# Altium schematic sheet Schema_Soldeerbout4.SchDoc
size A4; SheetNumber: 5; SheetTotal: 6
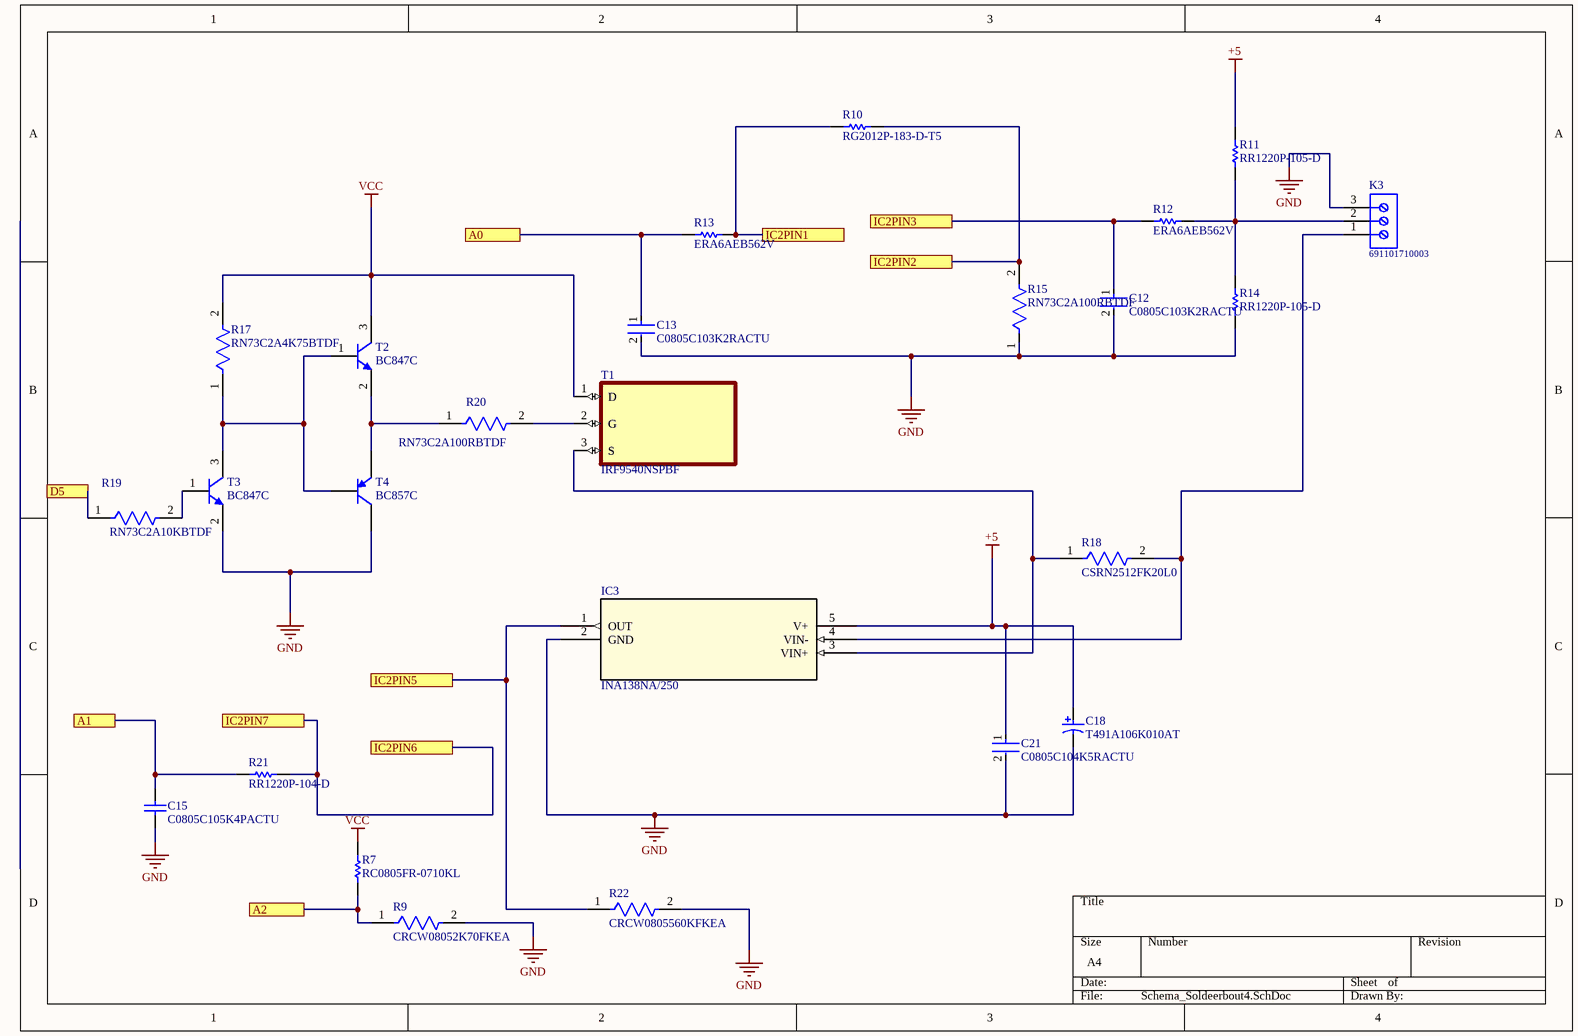
[diagram p0: Schema_Soldeerbout4.SchDoc]

## Parts
C12  C0805C103K2RACTU  [FP-C0805C-DN-MFG]
C13  C0805C103K2RACTU  [FP-C0805C-DN-MFG]
C15  C0805C105K4PACTU  [CAPC2013X145X50LL20T25]
C18  T491A106K010AT  [KEMT-A-3216-18-2_M]
C21  C0805C104K5RACTU  [FP-C0805C-DN-MFG]
IC3  INA138NA/250  [DBV5]
K3  691101710003  [691101710003]
R7  RC0805FR-0710KL  [RESC2013X60X35NL10T20]
R9  CRCW08052K70FKEA  [FP-CRCW0805-e3-IPC_C]
R10  RG2012P-183-D-T5  [RESC2013X50X40LL20T20]
R11  RR1220P-105-D  [RESC2013X50X40ML20T20]
R12  ERA6AEB562V  [RESC2013X60X40ML20T25]
R13  ERA6AEB562V  [RESC2013X60X40ML20T25]
R14  RR1220P-105-D  [RESC2013X50X40ML20T20]
R15  RN73C2A100RBTDF  [FP-RN732A-MFG]
R17  RN73C2A4K75BTDF  [FP-RN732A-MFG]
R18  CSRN2512FK20L0  [FP-CSRN2512-IPC_C]
R19  RN73C2A10KBTDF  [FP-RN732A-MFG]
R20  RN73C2A100RBTDF  [FP-RN732A-MFG]
R21  RR1220P-104-D  [RESC2013X50X40LL20T20]
R22  CRCW0805560KFKEA  [FP-CRCW0805-e3-IPC_A]
T1  IRF9540NSPBF  [DPAK508P1524X483-3N]
T2  BC847C  [INF-SOT23_L]
T3  BC847C  [INF-SOT23_L]
T4  BC857C  [INF-SOT23_N]

## Ports
A0, A1, A2, D5, IC2PIN1, IC2PIN2, IC2PIN3, IC2PIN5, IC2PIN6, IC2PIN7

## Nets
+5: C18.1 C21.1 IC3.5(V+) R11.2
GND: C12.2 C13.2 C15.1 C18.2 C21.2 IC3.2(GND) K3.3 R9.2 R14.1 R15.1 R22.2 T3.2(E) T4.3(C)
VCC: R7.2 R17.2 T1.1(D) T2.3(C)
A0: C13.1 R13.1 ; port A0
A1: C15.2 R21.1 ; port A1
A2: R7.1 R9.1 ; port A2
D5: R19.1 ; port D5
IC2PIN1: R10.1 R13.2 ; port IC2PIN1
IC2PIN2: R10.2 R15.2 ; port IC2PIN2
IC2PIN3: C12.1 R12.1 ; port IC2PIN3
IC2PIN5: IC3.1(OUT) R22.1 ; port IC2PIN5
IC2PIN6: R21.2 ; port IC2PIN6, port IC2PIN7
NetIC3_3: IC3.3(VIN+) R18.1 T1.3(S)
NetIC3_4: IC3.4(VIN-) K3.1 R18.2
NetK3_2: K3.2 R11.1 R12.2 R14.2
NetR17_1: R17.1 T2.1(B) T3.3(C) T4.1(B)
NetR19_2: R19.2 T3.1(B)
NetR20_1: R20.1 T2.2(E) T4.2(E)
NetR20_2: R20.2 T1.2(G)

## Library data of the parts
C12 C13 = CMP-2007-00259-2: CAP CER 10000PF 200V X7R 0805; Manufacturer: KEMET; Material: Ceramic; Temperature Coefficient: 30ppm/°C; Capacitance: 10,000 pF; Tolerance: 0.1; Value: 10,000 pF; Device Class L2: Capacitors; Voltage Rating: 200 V; Temperature Range High: +125°C; ComponentLink2Description: Datasheet; Height: 0.88mm; Octopart: https://octopart.com/c0805c103k2ractu-kemet-9138347; ComponentLink2URL: https://content.kemet.com/datasheets/KEM_C1003_C0G_SMD.pdf; Category: Cap; Temperature: -55°C to +125°C; Temperature Range Low: -55°C; Digikey Description: CAP CER 10000PF 200V X7R 0805; Manufacturer Part Number: C0805C103K2RACTU; Temperature Characteristic: X7R; Automotive: No; Device Class L3: Ceramic Capacitors; Mouser Description: KEMET - C0805C103K2RACTU - CAP, MLCC, X7R, 10NF, 200V, 0805; RoHS: TRUE; Device Class L1: Passive Components; Lead Free: Yes; Package: C0805C-DN; Ipc Land Pattern Name: CAPC200125X78
C15 = CMP-1036-04746-2: Manufacturer: Kemet; Part Number: C0805C105K4PACTU
C18 = CMP-2000-05172-1: Capacitor, Tantalum, 10 uF, +/- 10%, 10 V, -55 to 125 degC, 2-Pin SMD (1206), RoHS, Tape and Reel; Manufacturer Size Code: A; Manufacturer: Kemet; Type: Molded; Online Catalog: T491Series; Other Names: 399-3684-2; Voltage - Rated: 10V; Lifetime @ Temp.: 2000Hrs@85degC; Product Training Modules: CapacitorBasics-TypicalUsesforCapacitorsDeratingGuidelinesforSurfaceMountTantalumCapacitors; ESR (Equivalent Series Resistance): 3.8Ohm; Capacitance: 10µF; Catalog Drawings: T49x,T5xxSeries_A-side1T49x,T5xxSeries_A,B-side2T49x,T5xxSeries_A,SBottom; Family: TantalumCapacitors; Manufacturer URL: http://www.kemet.com/; Datasheet URL: http://www.farnell.com/datasheets/1824869.pdf; Package Reference: 1206; Packaging: Tape&Reel(TR); Series: T491; Operating Temperature: -55degC~125degC; Mounting Type: SurfaceMount; Height - Seated (Max): 0.071"(1.80mm); Package / Case: 1206(3216Metric); Package Description: 2-Pin Surface Mount Device, Body 3.2 x 1.6 mm; Features: GeneralPurpose; Tolerance: ±10%; Lead Spacing: -; Size / Dimension: 0.126"Lx0.063"W(3.20mmx1.60mm); Standard Package: 2,000; Datasheet Version: Apr-14; Category: Capacitors
C21 = CMP-2007-00279-2: CAP CER 0.1UF 50V X7R 0805; Manufacturer: KEMET; Value: 0.10 μF; Tolerance: 0.1; Temperature Coefficient: 30ppm/°C; Material: Ceramic; Manufacturer Part Number: C0805C104K5RACTU; Device Class L2: Capacitors; Temperature Range Low: -55°C; Voltage Rating: 50 V; Digikey Description: CAP CER 0.1UF 50V X7R 0805; Category: Cap; ComponentLink2Description: Datasheet; Octopart: https://octopart.com/c0805c104k5ractu-kemet-143926; RoHS: TRUE; ComponentLink2URL: https://content.kemet.com/datasheets/KEM_C1003_C0G_SMD.pdf; Temperature Characteristic: X7R; Temperature: -55°C to +125°C; Height: 0.88mm; Temperature Range High: +125°C; Device Class L1: Passive Components; Automotive: No; Lead Free: Yes; Ipc Land Pattern Name: CAPC200125X78; Device Class L3: Ceramic Capacitors; Mouser Description: Cap Ceramic 0.1uF 50V X7R 10% SMD 2.0 x 1.2 mm 125 C Paper T/R; Capacitance: 0.10 μF; Package: C0805C-DN
IC3 = INA138NA/250: High-Side Measurement Current Shunt Monitor, Current Output; Manufacturer: Texas Instruments; GENERIC_PART_NUMBER: INA138; INDUSTRY_STD_PKG_TYPE: SOT-23; PIN_COUNT: 5; PACKAGE_DESIGNATOR: DBV; Datasheet_URL: http://www.ti.com/lit/gpn/INA138; FAMILY_NAME: CURRENT SHUNT MONITOR; Vendor: Texas Instruments; Manufacturer_Part_Number: INA138NA/250; Copyright: Copyright (C) 2018 Accelerated Designs. All rights reserved; RefDes: RefDes; Type: DEV
K3 = CMP-1502-03257-1: Series 101 - 5.00 mm Horizontal Entry Modular with Pressure Clamp WR-TBL, 3 pin; Manufacturer: Wurth Elektronik; Pitch: 5.00mm; Pin Number: 3; Publisher: WurthElektronik; Part Number: 691101710003; Operating Temperature: -40to105degC; Package Reference: 691101710003; Packaging: Box; Manufacturer URL: http://www.we-online.de; Datasheet URL: http://katalog.we-online.de/em/datasheet/6911017100xx.pdf; Mounting Technology: THT
R7 = CMP-1659-00013-4: Chip Resistor, 10 KOhm, +/- 1%, 0.125 W, -55 to 155 degC, 0805 (2012 Metric), RoHS, Tape and Reel; Manufacturer: Yageo; Voltage Rating: 150 V; Mount: Surface Mount; ComponentLink1Description: Manufacturer URL; ComponentLink2URL: http://www.yageo.com/documents/recent/PYu-RC_Group_51_RoHS_L_04.pdf; Pins: 2; Length: 2 mm; Min Operating Temperature: -55 degC; Height: 0.5 mm; Mounting Technology: Surface Mount; RoHSCompliant: true; REACH SVHC: No SVHC; ComponentLink1URL: http://www.yageo.com/; Max Operating Temperature: 155 degC; PackageReference: 0805; DatasheetVersion: Rev. 4, 02/2016; Package Quantity: 5000; Packaging: Tape and Reel; ComponentLink2Description: Datasheet; PackageDescription: 2-Pin Surface Mounted Device, Body 2 x 1.25 mm
R9 = CMP-1013-00557-4: RES Thick Film, 2.7kΩ, 1%, 0.125W, 100ppm/°C, 0805; Voltage Rating (DC): 150V; Power Rating: 125mW; Resistance: 2.7kR; Composition: Thick Film; Mount: Surface Mount; Case Code (Imperial): 0805; Features: Automotive AEC-Q200; Depth: 1.25mm; Height: 0.45mm; Weight: 0.000194oz; Min Operating Temperature: -55°C; Case Code (Metric): 2012; Number of Pins: 2; Packaging: Tape and Reel; Width: 1.25mm; Military Standard: Not; Max Power Dissipation: 125mW; Tolerance: 1%; Case/Package: 0805; Lead Free: Lead Free; Max Operating Temperature: 155°C; Number of Terminations: 2; Voltage Rating: 150V; Contact Plating: Tin; Length: 2mm; Termination: SMD/SMT; Package Quantity: 10; Temperature Coefficient: 100ppm/°C; Radiation Hardening: No
R10 = CMP-2001-02814-1: Manufacturer: Susumu; Part Number: RG2012P-183-D-T5
R11 R14 = CMP-2001-03219-1: Manufacturer: Susumu; Part Number: RR1220P-105-D
R12 R13 = CMP-2001-00653-1: Manufacturer: Panasonic; Part Number: ERA6AEB562V
R15 R20 = CMP-03211-000756-1: SMD Chip Resistor, Thin Film, 100Ω, 100 V, 0805 [2012 Metric], 100 mW, 0.1%, RN73 Series; Manufacturer: TE Connectivity; Voltage Rating: 100V; Temperature Coefficient: 10ppm/°C; Power Rating: 0.1W; Temperature Range Low: -55°C; Ipc Land Pattern Name: RESC200125X55; Series: RN73; ComponentLink2URL: https://www.te.com/commerce/DocumentDelivery/DDEController?Action=showdoc&DocId=Data+Sheet%7F1773270%7FP%7Fpdf%7FEnglish%7FENG_DS_1773270_P.pdf%7F1676162-2; Composition: Thin Film; Value: 100Ω; Device Class L1: Passive Components; Device Class L3: Chip SMD Resistors; Lead Free: Yes; Octopart: https://octopart.com/rn73c2a100rbtdf-te+connectivity-41188433; Temperature: -55°C to 155°C; packaging: 1000 Reel; Tolerance: 0.1%; Height: 0.65mm; Manufacturer Part Number: RN73C2A100RBTDF; Automotive: No; Temperature Range High: 155°C; Resistance: 100Ω; RoHS: TRUE; Category: Res; octopart_url: https://octopart.com/rn73c2a100rbtdf-te+connectivity-41188433; Package: RN732A; ComponentLink2Description: Datasheet; Device Class L2: Resistors
R17 = CMP-03211-008984-1: SMD Chip Resistor, Thin Film, 4.75KΩ, 100 V, 0805 [2012 Metric], 100 mW, 0.1%, RN73 Series; Manufacturer: TE Connectivity; Voltage Rating: 100V; Temperature Coefficient: 10ppm/°C; Power Rating: 0.1W; Lead Free: Yes; RoHS: TRUE; Height: 0.65mm; ComponentLink2Description: Datasheet; Device Class L3: Chip SMD Resistors; Device Class L1: Passive Components; Device Class L2: Resistors; Automotive: No; packaging: 1000 Reel; octopart_url: https://octopart.com/rn73c2a4k75btdf-te+connectivity-21411993; Manufacturer Part Number: RN73C2A4K75BTDF; Temperature: -55°C to 155°C; Tolerance: 0.1%; Ipc Land Pattern Name: RESC200125X55; Temperature Range High: 155°C; Value: 4.75KΩ; Composition: Thin Film; ComponentLink2URL: https://www.te.com/commerce/DocumentDelivery/DDEController?Action=showdoc&DocId=Data+Sheet%7F1773270%7FP%7Fpdf%7FEnglish%7FENG_DS_1773270_P.pdf%7F1676162-2; Temperature Range Low: -55°C; Series: RN73; Package: RN732A; Category: Res; Octopart: https://octopart.com/rn73c2a4k75btdf-te+connectivity-21411993; Resistance: 4.75KΩ
R18 = CMP-26527-002510-1: Res Thick Film 2512 20mΩ 1% 2W ±200ppm/°C Molded SMD Plastic T/R; Resistance: 20mR; Case/Package: 2512; Case Code (Metric): 6432; Length: 0.25inch; Temperature Coefficient: 200ppm/°C; Width: 0.124inch; Min Operating Temperature: -55°C; Packaging: Tape and Reel; Max Operating Temperature: 155°C; Height: 0.028inch; Number of Terminations: 2; Contact Plating: Tin; Max Power Dissipation: 2W; Case Code (Imperial): 2512; Resistor Type: Thick Film; Depth: 3.15mm; RoHS Compliant: Yes; Series: CSRN; Size Code: 2512; Military Standard: Not; Lead Free: Lead Free; Tolerance: 1%; Power Rating: 2W; Mount: Surface Mount; Radiation Hardening: No; Construction: Rectangular
R19 = CMP-03211-000130-1: SMD Chip Resistor, Thin Film, 10KΩ, 100 V, 0805 [2012 Metric], 100 mW, 0.1%, RN73 Series; Manufacturer: TE Connectivity; Power Rating: 0.1W; Temperature Coefficient: 10ppm/°C; Voltage Rating: 100V; Package: RN732A; Ipc Land Pattern Name: RESC200125X55; RoHS: TRUE; packaging: 1000 Reel; Resistance: 10KΩ; Octopart: https://octopart.com/rn73c2a10kbtdf-te+connectivity-21400356; Temperature Range Low: -55°C; Device Class L1: Passive Components; Tolerance: 0.1%; ComponentLink2URL: https://www.te.com/commerce/DocumentDelivery/DDEController?Action=showdoc&DocId=Data+Sheet%7F1773270%7FP%7Fpdf%7FEnglish%7FENG_DS_1773270_P.pdf%7F1676162-2; Height: 0.65mm; Composition: Thin Film; Temperature Range High: 155°C; Automotive: No; Series: RN73; Lead Free: Yes; Value: 10KΩ; Category: Res; Device Class L2: Resistors; Temperature: -55°C to 155°C; octopart_url: https://octopart.com/rn73c2a10kbtdf-te+connectivity-21400356; Device Class L3: Chip SMD Resistors; ComponentLink2Description: Datasheet; Manufacturer Part Number: RN73C2A10KBTDF
R21 = CMP-2001-03217-1: Manufacturer: Susumu; Part Number: RR1220P-104-D
R22 = CMP-2001-04009-2: RES Thick Film, 560kΩ, 1%, 0.125W, 100ppm/°C, 0805; Max Power Dissipation: 125mW; Voltage Rating (DC): 150V; Resistance: 560kR; Temperature Coefficient: 100ppm/°C; Contact Plating: Tin; Case/Package: 0805; Power Rating: 125mW; Lead Free: Lead Free; Case Code (Metric): 2012; Case Code (Imperial): 0805; Termination: SMD/SMT; Width: 0.049inch; Features: Automotive AEC-Q200; Weight: 0.000194oz; Max Operating Temperature: 155°C; Number of Terminations: 2; Length: 2mm; Military Standard: Not; Package Quantity: 10; Tolerance: 1%; Radiation Hardening: No; Composition: Thick Film; Height: 0.45mm; Min Operating Temperature: -55°C; Packaging: Tape and Reel; Voltage Rating: 150V; Depth: 1.25mm
T1 = IRF9540NSPBF: RoHS Compliant | Low RDS(on) | Industry-leading quality | Dynamic dv/dt Rating | Fast Switching | Fully Avalanche Rated | 175C Operating Temperature | P-Channel MOSFET; MF: Infineon; Value: *; Price: None; Package: D2PAK Infineon; Check_prices: https://www.snapeda.com/parts/IRF9540NSPBF/Infineon%20Technologies/view-part/572451/?ref=eda; Availability: Unavailable; SnapEDA_Link: https://www.snapeda.com/parts/IRF9540NSPBF/Infineon%20Technologies/view-part/572451/?ref=snap; MP: IRF9540NSPBF
T2 T3 = CMP-1177-00037-1: NPN Silicon AF Transistor, 45 V VCEO, 100 mA IC, SOT23, Reel, Green; Manufacturer: Infineon; VCEO (max): 45Â V; VEBO (max): 6Â V; fT (typ): 250Â MHz; VCBO (max): 50Â V; ICM (max): 200Â mA; Green: TRUE; IC (max): 100Â mA; Ptot (max): 330Â mW; ICBO (max): 15Â nA; PartNumber: BC847C; ComponentLink3URL: http://www.infineon.com/dgdl/SOT23-Package_Overview.pdf?folderId=db3a30431936bc4b0119532290053c66&fileId=db3a30431936bc4b0119533468123c85; ComponentLink3Description: Package Specification; Mounting Technology: Surface Mount; PackageDescription: 3-Pin Small Outline Transistor Package, 1.3 x 2.9 mm Body, 0.95 mm Pitch; PackageReference: SOT23; ComponentLink2URL: http://www.infineon.com/dgdl/bc847series_bc848series_bc849series_bc850series.pdf?folderId=db3a304314dca389011541d30fa21656&fileId=db3a304314dca389011541d4630a1657; ComponentLink2Description: Datasheet; ComponentLink1Description: Manufacturer URL; Polarity: NPN; ComponentLink1URL: http://www.infineon.com/; IBM (max): 200Â mA; Packing: Reel; PackageVersion: Apr-08
T4 = CMP-1177-00039-1: PNP Silicon AF Transistor, 45 V VCEO, 100 mA IC, SOT23, Reel, Green; Manufacturer: Infineon; VCBO (max): 50Â V; fT (typ): 250Â MHz; ICBO (max): 15Â nA; IC (max): 100Â mA; Green: TRUE; IBM (max): 200Â mA; VEBO (max): 5Â V; VCEO (max): 45Â V; Ptot (max): 330Â mW; PackageDescription: 3-Pin Small Outline Transistor Package, 1.3 x 2.9 mm Body, 0.95 mm Pitch; ComponentLink2Description: Datasheet; PackageReference: SOT23; ComponentLink3Description: Package Specification; ComponentLink1URL: http://www.infineon.com/; ComponentLink1Description: Manufacturer URL; Mounting Technology: Surface Mount; PackageVersion: Apr-08; ComponentLink3URL: http://www.infineon.com/dgdl/SOT23-Package_Overview.pdf?folderId=db3a30431936bc4b0119532290053c66&fileId=db3a30431936bc4b0119533468123c85; ComponentLink2URL: http://www.infineon.com/dgdl/bc857series_bc858series_bc859series_bc860series.pdf?folderId=db3a304314dca389011541d30fa21656&fileId=db3a304314dca389011541da0e3a1661; Polarity: PNP; ICM (max): 200Â mA; PartNumber: BC857C; Packing: Reel